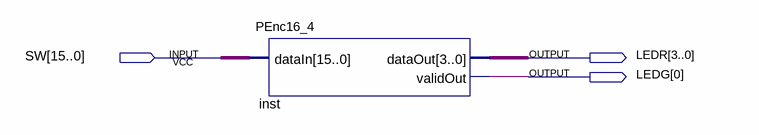
[diagram p0: schematic sheet]
// Quartus schematic EncoderDemo.bdf as structural Verilog: 1 symbols, 3 pins
module EncoderDemo (
  input  [15:0] SW,
  output [3:0] LEDR,
  output [0:0] LEDG
);

  PEnc16_4 inst (.dataIn(SW), .dataOut(LEDR), .validOut(LEDG[0]));
endmodule
